# EasyEDA schematic pic24.json
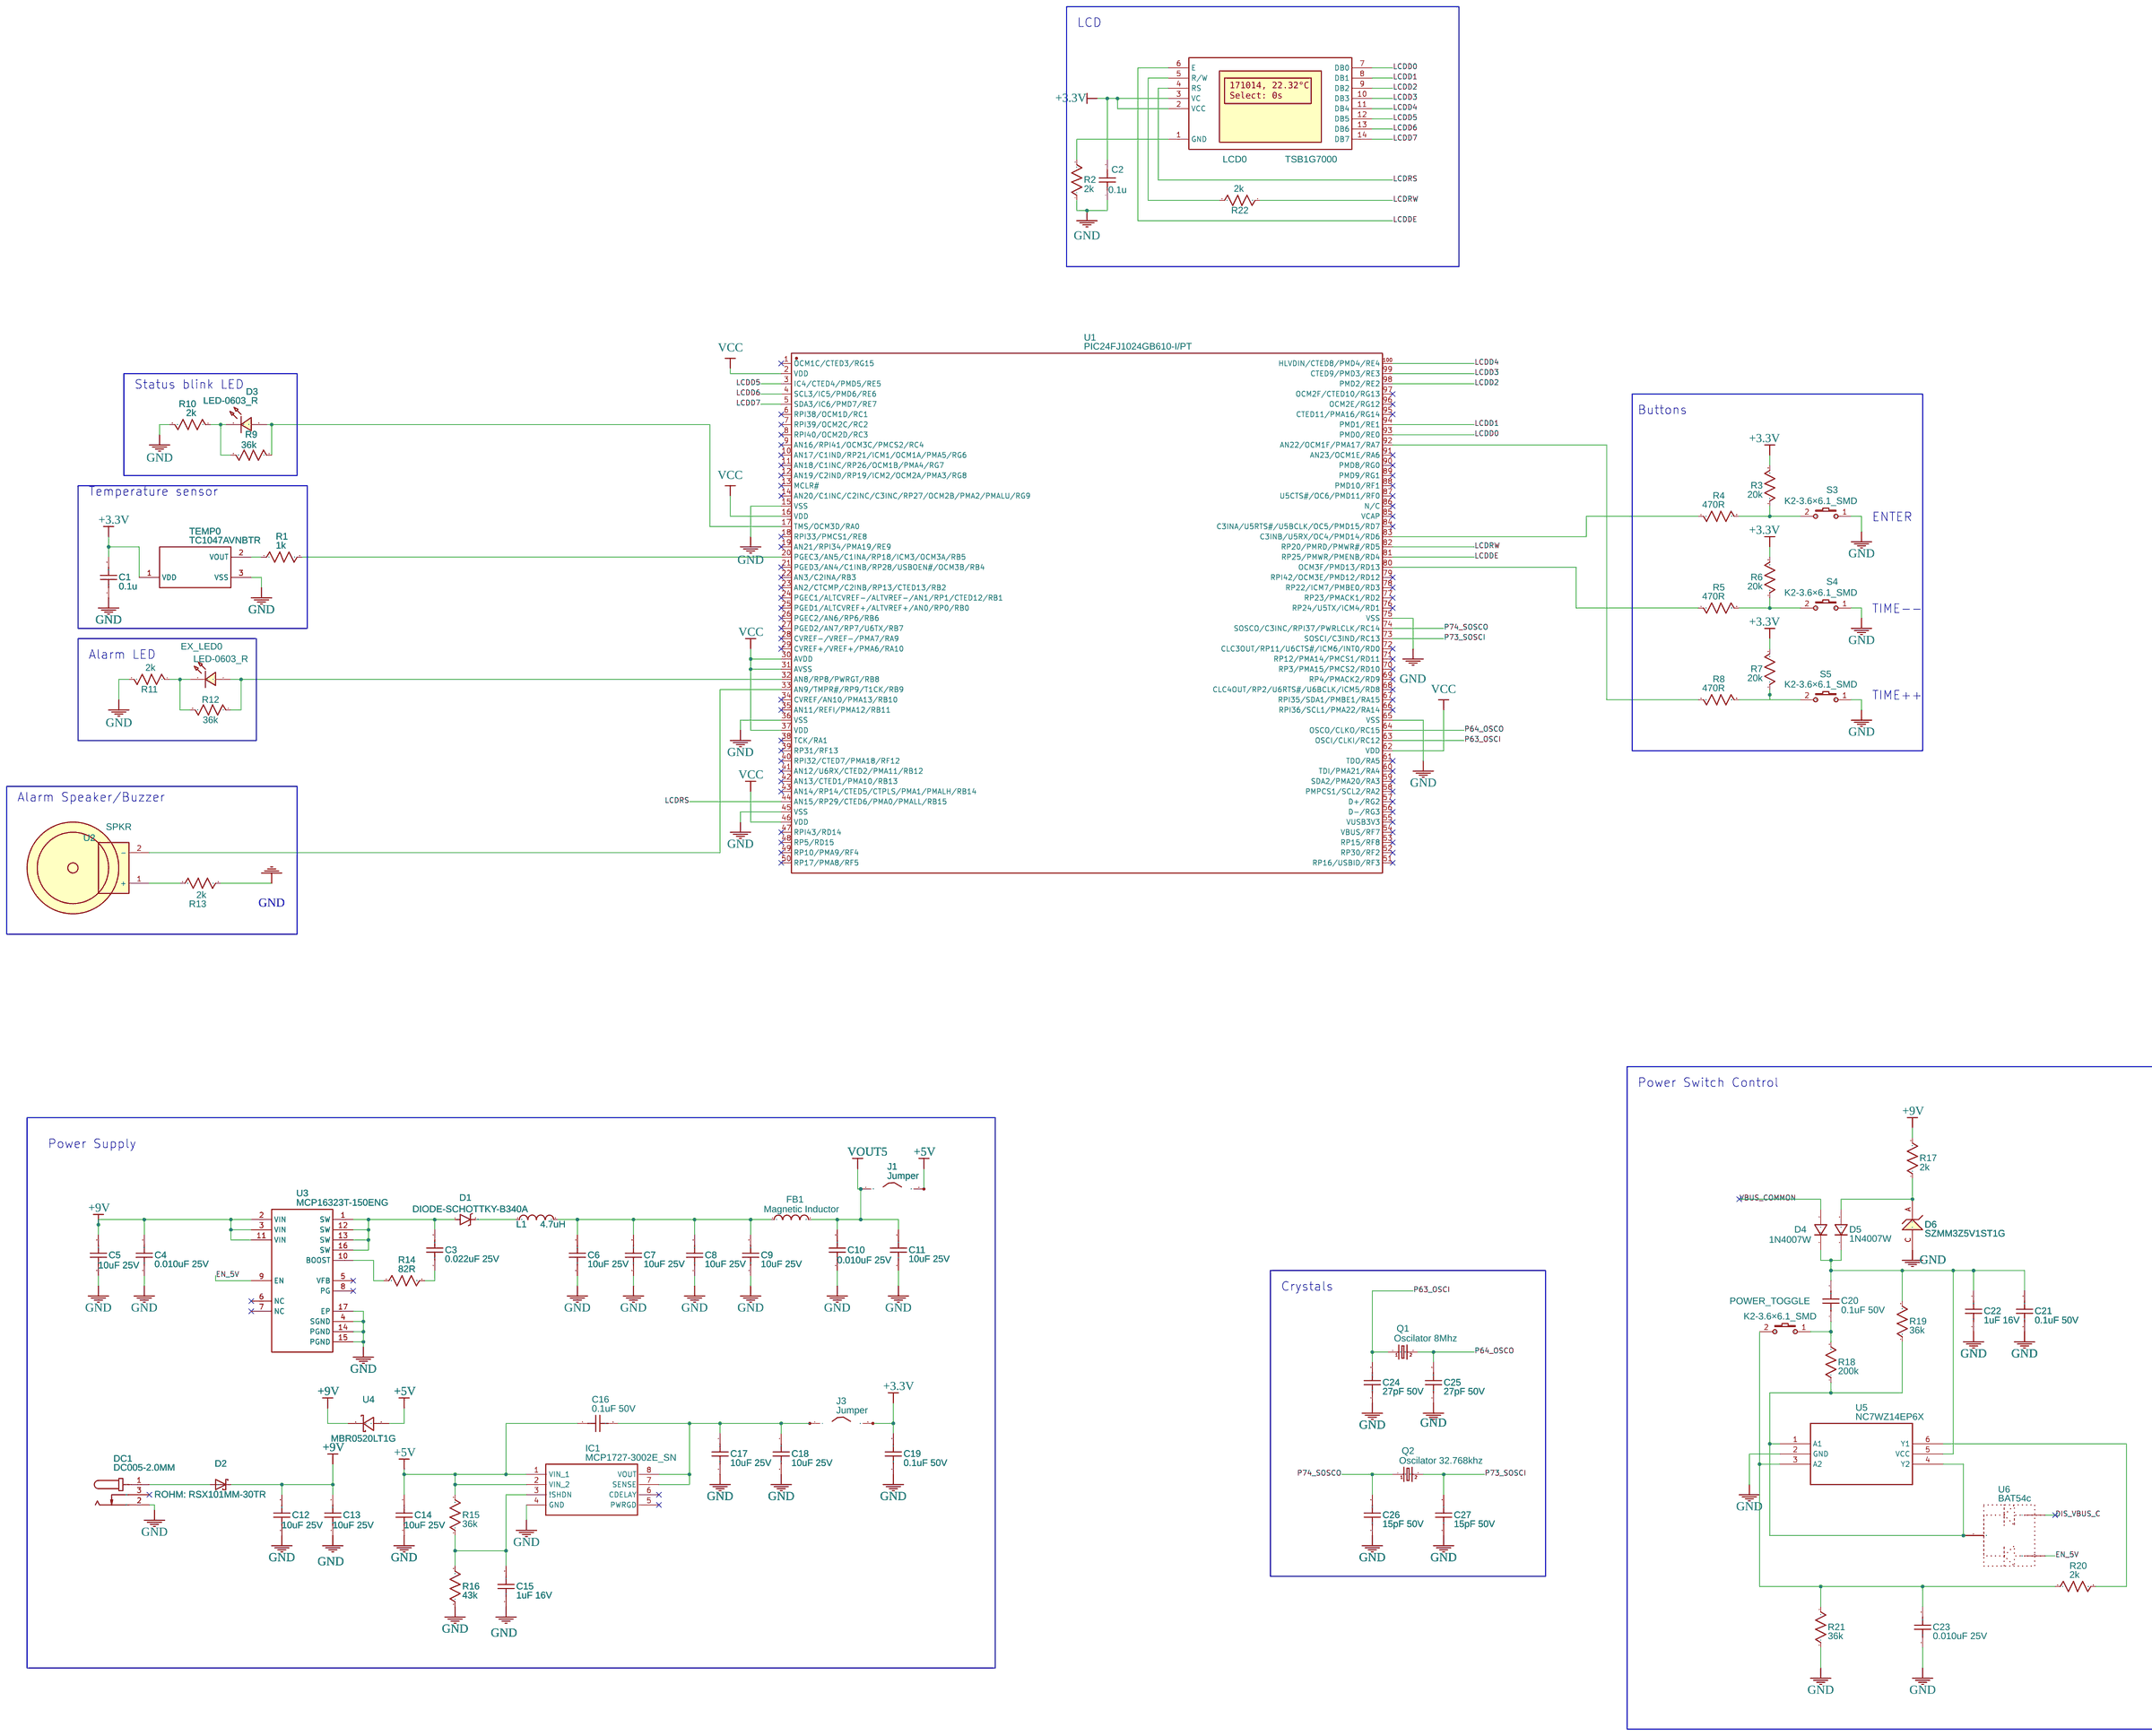
[diagram p0: schematic sheet]

## Parts
C1  0.1u  [C0603]
C2  0.1u  [C0603]
C3  0.022uF 25V  [C0603]
C4  0.010uF 25V  [C0603]
C5  10uF 25V  [C0805]
C6  10uF 25V  [C0603]
C7  10uF 25V  [C0603]
C8  10uF 25V  [C0603]
C9  10uF 25V  [C0603]
C10  0.010uF 25V  [C0805]
C11  10uF 25V  [C0603]
C12  10uF 25V  [C0805]
C13  10uF 25V  [C0805]
C14  10uF 25V  [C0805]
C15  1uF 16V  [C0603]
C16  0.1uF 50V  [C0603]
C17  10uF 25V  [C0805]
C18  10uF 25V  [C0805]
C19  0.1uF 50V  [C0603]
C20  0.1uF 50V  [C0603]
C21  0.1uF 50V  [C0603]
C22  1uF 16V  [C0603]
C23  0.010uF 25V  [C0603]
C24  27pF 50V  [C0603]
C25  27pF 50V  [C0603]
C26  15pF 50V  [C0603]
C27  15pF 50V  [C0603]
D1  DIODE-SCHOTTKY-B340A  [SMA-DIODE]
D2  ROHM: RSX101MM-30TR  [AXE_DIODO_SOD-123]
D3  LED-0603_R  [LED0603_RED]
D4  1N4007W  [SOD-123_L2.8-W1.8-LS3.7-RD]
D5  1N4007W  [SOD-123_L2.8-W1.8-LS3.7-RD]
D6  SZMM3Z5V1ST1G  [DIODE]
DC1  DC005-2.0MM  [DC-IN-TH_DC005]
EX_LED0  LED-0603_R  [LED0603_RED]
FB1  Magnetic Inductor  [INDUCTOR]
IC1  MCP1727-3002E_SN  [SOIC127P600X175-8N]
J1  Jumper  [JUMPER WIRE]
J3  Jumper  [JUMPER WIRE]
L1  4.7uH  [L0603]
LCD0  TSB1G7000  [LCD_FOOT_WIZARD]
POWER_TOGGLE  K2-3.6×6.1_SMD  [KEY-SMD_2P-L6.2-W3.6-LS8.0]
Q1  Oscilator 8Mhz  [R1206]
Q2  Oscilator 32.768khz  [R1206]
R1  1k  [R0603]
R2  2k  [R0603]
R3  20k  [R0603]
R4  470R  [R0603]
R5  470R  [R0603]
R6  20k  [R0603]
R7  20k  [R0603]
R8  470R  [R0603]
R9  36k  [R0603]
R10  2k  [R0603]
R11  2k  [R0603]
R12  36k  [R0603]
R13  2k  [R0603]
R14  82R  [R0603]
R15  36k  [R0603]
R16  43k  [R0603]
R17  2k  [R0603]
R18  200k  [R0603]
R19  36k  [R0603]
R20  2k  [R0603]
R21  36k  [R0603]
R22  2k  [R0603]
S3  K2-3.6×6.1_SMD  [KEY-SMD_2P-L6.2-W3.6-LS8.0]
S4  K2-3.6×6.1_SMD  [KEY-SMD_2P-L6.2-W3.6-LS8.0]
S5  K2-3.6×6.1_SMD  [KEY-SMD_2P-L6.2-W3.6-LS8.0]
TEMP0  TC1047AVNBTR  [SOT-23-3_L2.9-W1.6-P1.90-LS2.8-BR]
U1  PIC24FJ1024GB610-I/PT  [TQFP-100_L12.0-W12.0-P0.40-LS14.0-BL]
U2  SPKR  [SPEAKER_FOOT]
U3  MCP16323T-150ENG  [MCHP-VQFN-NG16]
U4  MBR0520LT1G  [MBR0520LT1G]
U5  NC7WZ14EP6X  [7×7MM]
U6  BAT54c  [BAT54C]

## Library data of the parts
C1-C4 C15 C16 C19-C27 = C_0603_US: Contributor: LCEDA_Lib
C5 C10 C12-C14 C17 C18 = C_0805_US: Contributor: LCEDA_Lib
C6-C9 C11 = C_0603_US: Contributor: LCEDA_Lib; Package Display: No
D1 = DIODE-SCHOTTKY-B340A: Schottky diodes in SFEs production catalog; Contributor: SparkFun
D2 = ROHM: RSX101MM-30TR: Contributor: Adafruit; Supplier Part: 755-RSX101MM-30TR; Supplier: Mouser; Price: 0.84
D3 EX_LED0 = LED-0603_R: Manufacturer: EVERLIGHT(台湾亿光); Manufacturer Part: 19-217/R6C-AL1M2VY/3T; Supplier Part: C72044; Supplier: LCSC; Contributor: LCEDA_01
D4 D5 = 1N4007W: Supplier: LCSC; Supplier Part: C328592; Manufacturer: BLUE ROCKET; Contributor: LCEDA_Lib
D6 = SZMM3Z5V1ST1G: Zener Voltage Regulator, 300 mW, Tight Tolerance Portfolio, 2-Pin SOD-323, Pb-Free, Tape and Reel
DC1 = DC005-2.0MM: Supplier: LCSC; Manufacturer: SOFNG; Supplier Part: C111567
FB1 = INDUCTOR: Contributor: Artyom_Nikolayev
IC1 = MCP1727-3002E_SN: Contributor: AlessiaBlundo
J1 J3 = JUMPER: Supplier Part: NONE; Manufacturer: NONE; Manufacturer Part: NONE; Contributor: 8963121007
L1 = L0603_US: Contributor: LCEDA_Lib
LCD0 = TSB1G7000: Contributor: rroarck
POWER_TOGGLE S3-S5 = K2-3.6×6.1_SMD: Supplier Part: C118141; Supplier: LCSC; Manufacturer Part: K2-1107ST-A4SW-06; Contributor: LCEDA_Lib; 制造商: 韩国韩荣
Q1 Q2 = Oscilator 8Mhz: sourceId: NLFXR9rJp
R1-R22 = R_0603_US: Contributor: LCEDA_Lib
TEMP0 = TC1047AVNBTR: Supplier: LCSC; Manufacturer: MICROCHIP(美国微芯); Supplier Part: C50052; JLCPCB Part Class: Extended Part
U1 = PIC24FJ1024GB610-I/PT: Supplier: LCSC; Supplier Part: C635616; Manufacturer: MICROCHIP(美国微芯); link: https://atta.szlcsc.comnull; Contributor: lcsc; JLCPCB Part Class: Extended Part
U2 = SPKR: Contributor: rroarck
U3 = MCP16323T-150ENG: High Efficiency Synchronous Buck Regulator with Power Good Indication, Input Voltage 6 to 18 V, Output Voltage 1.5 V, -40 to 125 degC, 16-pin VQFN (NG16), Tape and Reel
U4 = MBR0520LT1G: Contributor: pb158
U5 = NC7WZ14EP6X: Contributor: willrc627
U6 = BAT54c: Contributor: liciatucci; Convert to PCB: Yes; Add into BOM: Yes

## Nets
+3.3V: C1.2 C2.2 C19.2 J3.2 LCD0.2(VCC) LCD0.3(VC) R3.2 R6.2 R7.2 TEMP0.1(VDD)
+5V: C14.2 C16.1 IC1.1(VIN) IC1.2(VIN) J1.2 R15.2 U4.1(A)
+9V: C4.2 C5.2 C12.2 C13.2 D2.2(C) R17.2 U3.2(VIN) U3.3(VIN) U3.11(VIN) U4.2(K)
GND: C1.1 C2.1 C4.1 C5.1 C6.1 C7.1 C8.1 C9.1 C10.1 C11.1 C12.1 C13.1 C14.1 C15.1 C17.2 C18.2 C19.1 C21.1 C22.1 C23.1 C24.1 C25.1 C26.1 C27.1 D6.C(A) DC1.2 IC1.4(GND) R2.1 R10.2 R11.2 R13.1 R16.1 R21.1 S3.1 S4.1 S5.1 TEMP0.3(VSS) U1.15(VSS) U1.36(VSS) U1.45(VSS) U1.65(VSS) U1.75(VSS) U3.4(SGND) U3.14(PGND) U3.15(PGND) U3.17(EP) U5.2(GND)
VBUS_COMMON: D4.2
VCC: U1.2(VDD) U1.16(VDD) U1.30(AVDD) U1.31(AVSS) U1.37(VDD) U1.46(VDD) U1.62(VDD)
DIS_VBUS_C: U6.4
EN_5V: U3.9(EN) U6.5
LCDD0: LCD0.7(DB0) U1.93(PMD0/RE0)
LCDD1: LCD0.8(DB1) U1.94(PMD1/RE1)
LCDD2: LCD0.9(DB2) U1.98(PMD2/RE2)
LCDD3: LCD0.10(DB3) U1.99(CTED9/PMD3/RE3)
LCDD4: LCD0.11(DB4) U1.100(HLVDIN/CTED8/PMD4/RE4)
LCDD5: LCD0.12(DB5) U1.3(IC4/CTED4/PMD5/RE5)
LCDD6: LCD0.13(DB6) U1.4(SCL3/IC5/PMD6/RE6)
LCDD7: LCD0.14(DB7) U1.5(SDA3/IC6/PMD7/RE7)
LCDDE: LCD0.6(E) U1.81(RP25/PMWR/PMENB/RD4)
LCDRS: LCD0.4(RS) U1.44(AN15/RP29/CTED6/PMA0/PMALL/RB15)
LCDRW: R22.2 U1.82(RP20/PMRD/PMWR#/RD5)
P63_OSCI: C24.2 Q1.1(XTAL1) U1.63(OSCI/CLKI/RC12)
P64_OSCO: C25.2 Q1.2(XTAL2) U1.64(OSCO/CLKO/RC15)
P73_SOSCI: C27.2 Q2.2(XTAL2) U1.73(SOSCI/C3IND/RC13)
P74_SOSCO: C26.2 Q2.1(XTAL1) U1.74(SOSCO/C3INC/RPI37/PWRLCLK/RC14)
VOUT5: C10.2 C11.2 FB1.2 J1.1
Net-(C3-1): C3.1 R14.2
Net-(C3-2): C3.2 D1.A U3.1(SW) U3.12(SW) U3.13(SW) U3.16(SW)
Net-(C6-2): C6.2 C7.2 C8.2 C9.2 FB1.1 L1.2
Net-(C15-2): C15.2 IC1.3(!SHDN) R15.1 R16.2
Net-(C16-2): C16.2 C17.1 C18.1 IC1.7(SENSE) IC1.8(VOUT) J3.1
Net-(C20-1): C20.1 POWER_TOGGLE.1 R18.2
Net-(C20-2): C20.2 C21.2 C22.2 D4.1 D5.1 R19.2 U5.5(VCC)
Net-(C23-2): C23.2 POWER_TOGGLE.2 R20.1 R21.2 U5.3(A2)
Net-(D1-C): D1.C L1.1
Net-(D2-1): D2.1(A) DC1.1
Net-(D3-1): D3.1 R9.1 U1.17(TMS/OCM3D/RA0)
Net-(D3-2): D3.2 R9.2 R10.1
Net-(D5-2): D5.2 D6.A(K) R17.1
Net-(EX_LED0-1): EX_LED0.1 R12.1 U1.32(AN8/RP8/PWRGT/RB8)
Net-(EX_LED0-2): EX_LED0.2 R11.1 R12.2
Net-(LCD0-1): LCD0.1(GND) R2.2
Net-(LCD0-5): LCD0.5(R/W) R22.1
Net-(R1-1): R1.1 TEMP0.2(VOUT)
Net-(R1-2): R1.2 U1.20(PGEC3/AN5/C1INA/RP18/ICM3/OCM3A/RB5)
Net-(R3-1): R3.1 R4.2 S3.2
Net-(R4-1): R4.1 U1.83(C3INB/U5RX/OC4/PMD14/RD6)
Net-(R5-1): R5.1 U1.80(OCM3F/PMD13/RD13)
Net-(R5-2): R5.2 R6.1 S4.2
Net-(R7-1): R7.1 R8.2 S5.2
Net-(R8-1): R8.1 U1.92(AN22/OCM1F/PMA17/RA7)
Net-(R13-2): R13.2 U2.1(+)
Net-(R14-1): R14.1 U3.10(BOOST)
Net-(R18-1): R18.1 R19.1 U5.1(A1) U5.4(Y2) U6.6
Net-(R20-2): R20.2 U5.6(Y1)
Net-(U1-33): U1.33(AN9/TMPR#/RP9/T1CK/RB9) U2.2(-)

Not connected (* = marked no-connect by the designer): DC1 3*; IC1 5(PWRGD)* 6(CDELAY)*; U1 1(OCM1C/CTED3/RG15)* 6(RPI38/OCM1D/RC1)* 7(RPI39/OCM2C/RC2)* 8(RPI40/OCM2D/RC3)* 9(AN16/RPI41/OCM3C/PMCS2/RC4)* 10(AN17/C1IND/RP21/ICM1/OCM1A/PMA5/RG6)* 11(AN18/C1INC/RP26/OCM1B/PMA4/RG7)* 12(AN19/C2IND/RP19/ICM2/OCM2A/PMA3/RG8)* 13(MCLR#)* 14(AN20/C1INC/C2INC/C3INC/RP27/OCM2B/PMA2/PMALU/RG9)* 18(RPI33/PMCS1/RE8)* 19(AN21/RPI34/PMA19/RE9)* 21(PGED3/AN4/C1INB/RP28/USBOEN#/OCM3B/RB4)* 22(AN3/C2INA/RB3)* 23(AN2/CTCMP/C2INB/RP13/CTED13/RB2)* 24(PGEC1/ALTCVREF-/ALTVREF-/AN1/RP1/CTED12/RB1)* 25(PGED1/ALTCVREF+/ALTVREF+/AN0/RP0/RB0)* 26(PGEC2/AN6/RP6/RB6)* 27(PGED2/AN7/RP7/U6TX/RB7)* 28(CVREF-/VREF-/PMA7/RA9)* 29(CVREF+/VREF+/PMA6/RA10)* 34(CVREF/AN10/PMA13/RB10)* 35(AN11/REFI/PMA12/RB11)* 38(TCK/RA1)* 39(RP31/RF13)* 40(RPI32/CTED7/PMA18/RF12)* 41(AN12/U6RX/CTED2/PMA11/RB12)* 42(AN13/CTED1/PMA10/RB13)* 43(AN14/RP14/CTED5/CTPLS/PMA1/PMALH/RB14)* 47(RPI43/RD14)* 48(RP5/RD15)* 49(RP10/PMA9/RF4)* 50(RP17/PMA8/RF5)* 51(RP16/USBID/RF3)* 52(RP30/RF2)* 53(RP15/RF8)* 54(VBUS/RF7)* 55(VUSB3V3)* 56(D-/RG3)* 57(D+/RG2)* 58(PMPCS1/SCL2/RA2)* 59(SDA2/PMA20/RA3)* 60(TDI/PMA21/RA4)* 61(TDO/RA5)* 66(RPI36/SCL1/PMA22/RA14)* 67(RPI35/SDA1/PMBE1/RA15)* 68(CLC4OUT/RP2/U6RTS#/U6BCLK/ICM5/RD8)* 69(RP4/PMACK2/RD9)* 70(RP3/PMA15/PMCS2/RD10)* 71(RP12/PMA14/PMCS1/RD11)* 72(CLC3OUT/RP11/U6CTS#/ICM6/INT0/RD0)* 76(RP24/U5TX/ICM4/RD1)* 77(RP23/PMACK1/RD2)* 78(RP22/ICM7/PMBE0/RD3)* 79(RPI42/OCM3E/PMD12/RD12)* 84(C3INA/U5RTS#/U5BCLK/OC5/PMD15/RD7)* 85(VCAP)* 86(N/C)* 87(U5CTS#/OC6/PMD11/RF0)* 88(PMD10/RF1)* 89(PMD9/RG1)* 90(PMD8/RG0)* 91(AN23/OCM1E/RA6)* 95(CTED11/PMA16/RG14)* 96(OCM2E/RG12)* 97(OCM2F/CTED10/RG13)*; U3 5(VFB)* 6(NC)* 7(NC)* 8(PG)*

## Notes on the sheet
- LCD
- Status blink LED
- Buttons
- Temperature sensor
- ENTER
- TIME--
- Alarm LED
- TIME++
- Alarm Speaker/Buzzer
- Power Switch Control
- Power Supply
- Crystals
